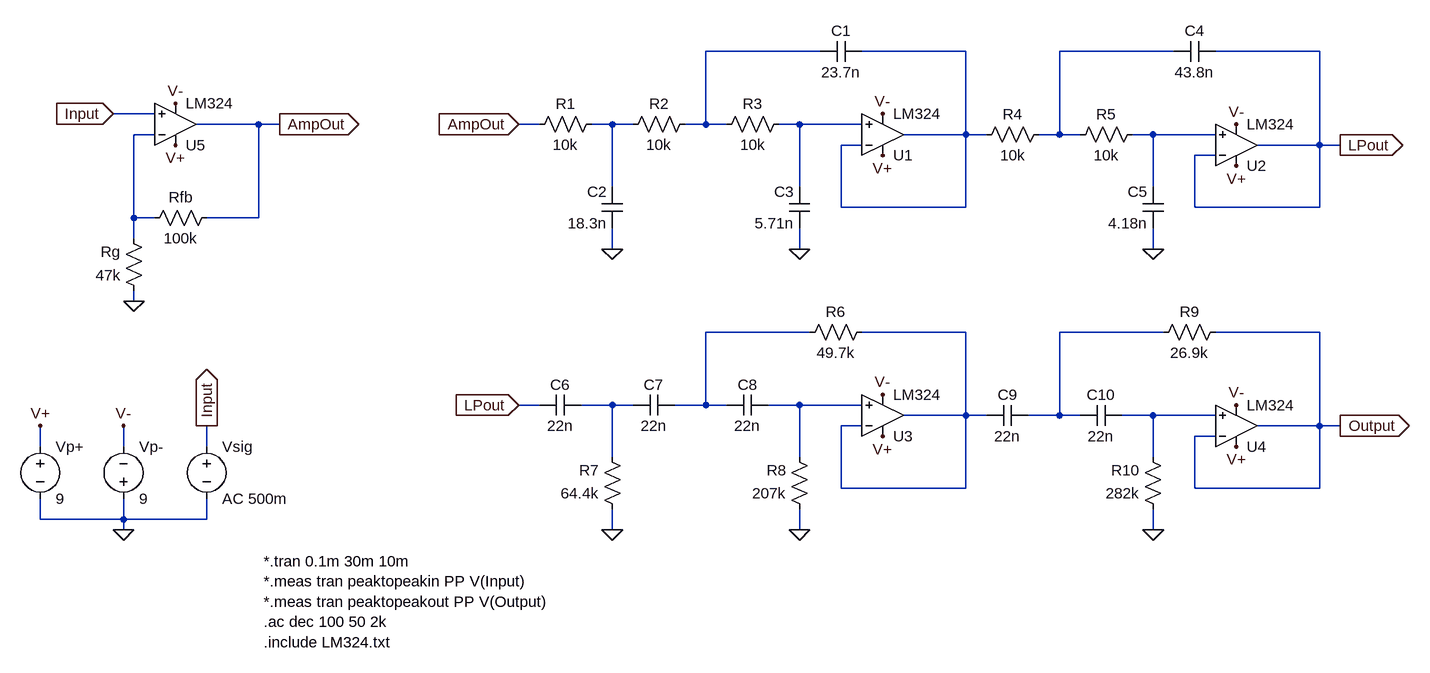
[diagram p0: schematic BandpassFilter.asc]
BandpassFilter.asc, the LTspice schematic file:
Version 4
SHEET 1 1372 1196
WIRE 368 256 192 256
WIRE 592 256 432 256
WIRE 912 256 736 256
WIRE 1136 256 976 256
WIRE -656 352 -720 352
WIRE -496 368 -592 368
WIRE -464 368 -496 368
WIRE -64 368 -96 368
WIRE 48 368 16 368
WIRE 80 368 48 368
WIRE 192 368 192 256
WIRE 192 368 160 368
WIRE 224 368 192 368
WIRE 336 368 304 368
WIRE 432 368 336 368
WIRE -656 384 -688 384
WIRE 592 384 592 256
WIRE 592 384 496 384
WIRE 624 384 592 384
WIRE 736 384 736 256
WIRE 736 384 704 384
WIRE 768 384 736 384
WIRE 880 384 848 384
WIRE 976 384 880 384
WIRE 432 400 400 400
WIRE 1136 400 1136 256
WIRE 1136 400 1040 400
WIRE 1168 400 1136 400
WIRE 976 416 944 416
WIRE 48 464 48 368
WIRE 336 464 336 368
WIRE 880 464 880 384
WIRE 400 496 400 400
WIRE 592 496 592 384
WIRE 592 496 400 496
WIRE 944 496 944 416
WIRE 1136 496 1136 400
WIRE 1136 496 944 496
WIRE -688 512 -688 384
WIRE -656 512 -688 512
WIRE -496 512 -496 368
WIRE -496 512 -576 512
WIRE -688 544 -688 512
WIRE 48 560 48 528
WIRE 336 560 336 528
WIRE 880 560 880 528
WIRE -688 640 -688 624
WIRE 352 688 192 688
WIRE 592 688 432 688
WIRE 896 688 736 688
WIRE 1136 688 976 688
WIRE -64 800 -96 800
WIRE 48 800 0 800
WIRE 80 800 48 800
WIRE 192 800 192 688
WIRE 192 800 144 800
WIRE 224 800 192 800
WIRE 336 800 288 800
WIRE 432 800 336 800
WIRE 592 816 592 688
WIRE 592 816 496 816
WIRE 624 816 592 816
WIRE 736 816 736 688
WIRE 736 816 688 816
WIRE 768 816 736 816
WIRE 880 816 832 816
WIRE 976 816 880 816
WIRE 432 832 400 832
WIRE 1136 832 1136 688
WIRE 1136 832 1040 832
WIRE 1168 832 1136 832
WIRE 976 848 944 848
WIRE -832 864 -832 832
WIRE -704 864 -704 832
WIRE -576 864 -576 832
WIRE 48 880 48 800
WIRE 336 880 336 800
WIRE 880 880 880 816
WIRE 400 928 400 832
WIRE 592 928 592 816
WIRE 592 928 400 928
WIRE 944 928 944 848
WIRE 1136 928 1136 832
WIRE 1136 928 944 928
WIRE -832 976 -832 944
WIRE -704 976 -704 944
WIRE -704 976 -832 976
WIRE -576 976 -576 944
WIRE -576 976 -704 976
WIRE -704 992 -704 976
WIRE 48 992 48 960
WIRE 336 992 336 960
WIRE 880 992 880 960
FLAG 48 560 0
FLAG 336 560 0
FLAG 880 560 0
FLAG 464 352 V-
FLAG 1008 368 V-
FLAG 464 416 V+
FLAG 1008 432 V+
FLAG 1168 400 LPout
IOPIN 1168 400 Out
FLAG -576 832 Input
IOPIN -576 832 Out
FLAG -832 832 V+
FLAG -704 832 V-
FLAG -704 992 0
FLAG 48 992 0
FLAG 336 992 0
FLAG 880 992 0
FLAG 464 784 V-
FLAG 1008 800 V-
FLAG 464 848 V+
FLAG 1008 864 V+
FLAG 1168 832 Output
IOPIN 1168 832 Out
FLAG -96 800 LPout
IOPIN -96 800 In
FLAG -624 336 V-
FLAG -624 400 V+
FLAG -688 640 0
FLAG -720 352 Input
IOPIN -720 352 In
FLAG -464 368 AmpOut
IOPIN -464 368 Out
FLAG -96 368 AmpOut
IOPIN -96 368 In
SYMBOL OpAmps\\opamp2 464 448 M180
SYMATTR InstName U1
SYMATTR Value LM324
SYMBOL res 32 352 R90
WINDOW 0 0 56 VBottom 2
WINDOW 3 32 56 VTop 2
SYMATTR InstName R1
SYMATTR Value 10k
SYMBOL res 176 352 R90
WINDOW 0 0 56 VBottom 2
WINDOW 3 32 56 VTop 2
SYMATTR InstName R2
SYMATTR Value 10k
SYMBOL res 320 352 R90
WINDOW 0 0 56 VBottom 2
WINDOW 3 32 56 VTop 2
SYMATTR InstName R3
SYMATTR Value 10k
SYMBOL cap 64 528 R180
WINDOW 0 24 56 Left 2
WINDOW 3 24 8 Left 2
SYMATTR InstName C2
SYMATTR Value 18.3n
SYMBOL res 720 368 R90
WINDOW 0 0 56 VBottom 2
WINDOW 3 32 56 VTop 2
SYMATTR InstName R4
SYMATTR Value 10k
SYMBOL cap 432 240 R90
WINDOW 0 0 32 VBottom 2
WINDOW 3 32 32 VTop 2
SYMATTR InstName C1
SYMATTR Value 23.7n
SYMBOL cap 352 528 R180
WINDOW 0 24 56 Left 2
WINDOW 3 24 8 Left 2
SYMATTR InstName C3
SYMATTR Value 5.71n
SYMBOL res 864 368 R90
WINDOW 0 0 56 VBottom 2
WINDOW 3 32 56 VTop 2
SYMATTR InstName R5
SYMATTR Value 10k
SYMBOL OpAmps\\opamp2 1008 464 M180
SYMATTR InstName U2
SYMATTR Value LM324
SYMBOL cap 976 240 R90
WINDOW 0 0 32 VBottom 2
WINDOW 3 32 32 VTop 2
SYMATTR InstName C4
SYMATTR Value 43.8n
SYMBOL cap 896 528 R180
WINDOW 0 24 56 Left 2
WINDOW 3 24 8 Left 2
SYMATTR InstName C5
SYMATTR Value 4.18n
SYMBOL voltage -832 848 R0
SYMATTR InstName Vp+
SYMATTR Value 9
SYMBOL voltage -704 960 M180
WINDOW 0 24 96 Left 2
WINDOW 3 24 16 Left 2
SYMATTR InstName Vp-
SYMATTR Value 9
SYMBOL voltage -576 848 R0
SYMATTR InstName Vsig
SYMATTR Value AC 500m
SYMBOL OpAmps\\opamp2 464 880 M180
SYMATTR InstName U3
SYMATTR Value LM324
SYMBOL OpAmps\\opamp2 1008 896 M180
SYMATTR InstName U4
SYMATTR Value LM324
SYMBOL cap 0 784 R90
WINDOW 0 0 32 VBottom 2
WINDOW 3 32 32 VTop 2
SYMATTR InstName C6
SYMATTR Value 22n
SYMBOL cap 144 784 R90
WINDOW 0 0 32 VBottom 2
WINDOW 3 32 32 VTop 2
SYMATTR InstName C7
SYMATTR Value 22n
SYMBOL cap 288 784 R90
WINDOW 0 0 32 VBottom 2
WINDOW 3 32 32 VTop 2
SYMATTR InstName C8
SYMATTR Value 22n
SYMBOL cap 688 800 R90
WINDOW 0 0 32 VBottom 2
WINDOW 3 32 32 VTop 2
SYMATTR InstName C9
SYMATTR Value 22n
SYMBOL cap 832 800 R90
WINDOW 0 0 32 VBottom 2
WINDOW 3 32 32 VTop 2
SYMATTR InstName C10
SYMATTR Value 22n
SYMBOL res 448 672 R90
WINDOW 0 0 56 VBottom 2
WINDOW 3 32 56 VTop 2
SYMATTR InstName R6
SYMATTR Value 49.7k
SYMBOL res 64 976 R180
WINDOW 0 36 76 Left 2
WINDOW 3 36 40 Left 2
SYMATTR InstName R7
SYMATTR Value 64.4k
SYMBOL res 352 976 R180
WINDOW 0 36 76 Left 2
WINDOW 3 36 40 Left 2
SYMATTR InstName R8
SYMATTR Value 207k
SYMBOL res 992 672 R90
WINDOW 0 0 56 VBottom 2
WINDOW 3 32 56 VTop 2
SYMATTR InstName R9
SYMATTR Value 26.9k
SYMBOL res 896 976 R180
WINDOW 0 36 76 Left 2
WINDOW 3 36 40 Left 2
SYMATTR InstName R10
SYMATTR Value 282k
SYMBOL OpAmps\\opamp2 -624 432 M180
SYMATTR InstName U5
SYMATTR Value LM324
SYMBOL res -560 496 R90
WINDOW 0 0 56 VBottom 2
WINDOW 3 32 56 VTop 2
SYMATTR InstName Rfb
SYMATTR Value 100k
SYMBOL res -672 640 R180
WINDOW 0 36 76 Left 2
WINDOW 3 36 40 Left 2
SYMATTR InstName Rg
SYMATTR Value 47k
TEXT -488 1040 Left 2 !*.tran 0.1m 30m 10m\n*.meas tran peaktopeakin PP V(Input)\n*.meas tran peaktopeakout PP V(Output)\n.ac dec 100 50 2k\n.include LM324.txt

The netlist it stands for:
* BandpassFilter.asc
XU1 N005 N002 V+ V- N002 LM324  ; pins In+ In- V+ V- OUT
R1 N004 AmpOut 10k
R2 N001 N004 10k
R3 N005 N001 10k
C2 0 N004 18.3n
R4 N003 N002 10k
C1 N002 N001 23.7n
C3 0 N005 5.71n
R5 N007 N003 10k
XU2 N007 LPout V+ V- LPout LM324  ; pins In+ In- V+ V- OUT
C4 LPout N003 43.8n
C5 0 N007 4.18n
Vp+ V+ 0 9
Vp- 0 V- 9
Vsig Input 0 AC 500m
XU3 N012 N009 V+ V- N009 LM324  ; pins In+ In- V+ V- OUT
XU4 N013 Output V+ V- Output LM324  ; pins In+ In- V+ V- OUT
C6 N011 LPout 22n
C7 N008 N011 22n
C8 N012 N008 22n
C9 N010 N009 22n
C10 N013 N010 22n
R6 N009 N008 49.7k
R7 0 N011 64.4k
R8 0 N012 207k
R9 Output N010 26.9k
R10 0 N013 282k
XU5 Input N006 V+ V- AmpOut LM324  ; pins In+ In- V+ V- OUT
Rfb AmpOut N006 100k
Rg 0 N006 47k
*.tran 0.1m 30m 10m
*.meas tran peaktopeakin PP V(Input)
*.meas tran peaktopeakout PP V(Output)
.ac dec 100 50 2k
.include LM324.txt
.backanno
.end